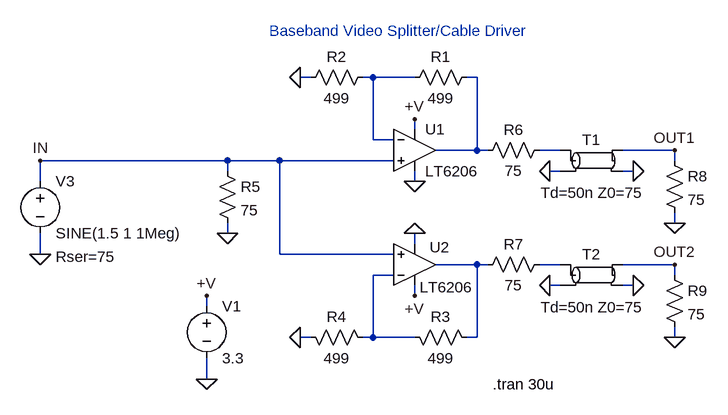
[diagram p0: schematic 6206.asc]
6206.asc, the LTspice schematic file:
Version 4
SHEET 1 896 740
WIRE 16 128 0 128
WIRE 112 128 96 128
WIRE 176 128 112 128
WIRE 272 128 256 128
WIRE 176 208 176 192
WIRE 112 224 112 128
WIRE 144 224 112 224
WIRE 272 240 272 128
WIRE 272 240 208 240
WIRE 288 240 272 240
WIRE 400 240 368 240
WIRE 576 240 496 240
WIRE -112 256 -400 256
WIRE -32 256 -112 256
WIRE 144 256 -32 256
WIRE 576 256 576 240
WIRE -112 272 -112 256
WIRE 400 272 384 272
WIRE 512 272 496 272
WIRE -400 288 -400 256
WIRE 176 288 176 272
WIRE 576 352 576 336
WIRE -112 368 -112 352
WIRE 176 384 176 368
WIRE -400 400 -400 368
WIRE -32 400 -32 256
WIRE 144 400 -32 400
WIRE 272 416 208 416
WIRE 288 416 272 416
WIRE 400 416 368 416
WIRE 576 416 496 416
WIRE 144 432 112 432
WIRE 576 432 576 416
WIRE 400 448 384 448
WIRE 512 448 496 448
WIRE 176 464 176 448
WIRE -144 480 -144 464
WIRE 16 528 0 528
WIRE 112 528 112 432
WIRE 112 528 96 528
WIRE 176 528 112 528
WIRE 272 528 272 416
WIRE 272 528 256 528
WIRE 576 528 576 512
WIRE -144 592 -144 560
FLAG -144 592 0
FLAG 176 192 +V
FLAG -144 464 +V
FLAG 0 128 0
FLAG -400 400 0
FLAG 176 288 0
FLAG 176 464 +V
FLAG 0 528 0
FLAG 176 368 0
FLAG -112 368 0
FLAG 576 240 OUT1
FLAG -400 256 IN
FLAG 576 352 0
FLAG 576 416 OUT2
FLAG 576 528 0
FLAG 384 272 0
FLAG 512 272 0
FLAG 384 448 0
FLAG 512 448 0
SYMBOL voltage -144 464 R0
SYMATTR InstName V1
SYMATTR Value 3.3
SYMBOL res 272 112 R90
WINDOW 0 0 56 VBottom 0
WINDOW 3 32 56 VTop 0
SYMATTR InstName R1
SYMATTR Value 499
SYMBOL res 112 112 R90
WINDOW 0 0 56 VBottom 0
WINDOW 3 32 56 VTop 0
SYMATTR InstName R2
SYMATTR Value 499
SYMBOL voltage -400 272 R0
WINDOW 123 0 0 Left 0
WINDOW 39 24 132 Left 0
SYMATTR InstName V3
SYMATTR Value SINE(1.5 1 1Meg)
SYMATTR SpiceLine Rser=75
SYMBOL res 272 544 M270
WINDOW 0 32 56 VTop 0
WINDOW 3 0 56 VBottom 0
SYMATTR InstName R3
SYMATTR Value 499
SYMBOL res 112 544 M270
WINDOW 0 32 56 VTop 0
WINDOW 3 0 56 VBottom 0
SYMATTR InstName R4
SYMATTR Value 499
SYMBOL res -128 256 R0
SYMATTR InstName R5
SYMATTR Value 75
SYMBOL res 384 224 R90
WINDOW 0 0 56 VBottom 0
WINDOW 3 32 56 VTop 0
SYMATTR InstName R6
SYMATTR Value 75
SYMBOL res 384 400 R90
WINDOW 0 0 56 VBottom 0
WINDOW 3 32 56 VTop 0
SYMATTR InstName R7
SYMATTR Value 75
SYMBOL res 560 240 R0
SYMATTR InstName R8
SYMATTR Value 75
SYMBOL res 560 416 R0
SYMATTR InstName R9
SYMATTR Value 75
SYMBOL tline 448 256 R0
WINDOW 3 2 34 Top 0
SYMATTR InstName T1
SYMATTR Value Td=50n Z0=75
SYMBOL tline 448 432 R0
WINDOW 3 2 34 Top 0
SYMATTR InstName T2
SYMATTR Value Td=50n Z0=75
SYMBOL opamps\\LT6206 176 240 R0
SYMATTR InstName U1
SYMBOL opamps\\LT6206 176 416 M180
WINDOW 0 23 27 Left 0
WINDOW 3 8 -35 Left 0
SYMATTR InstName U2
TEXT 296 600 Left 0 !.tran 30u
TEXT 152 72 Bottom 0 ;Baseband Video Splitter/Cable Driver

The netlist it stands for:
* 6206.asc
V1 +V 0 3.3
R1 N002 N001 499
R2 N001 0 499
V3 IN 0 SINE(1.5 1 1Meg) Rser=75
R3 N004 N006 499
R4 N006 0 499
R5 IN 0 75
R6 N003 N002 75
R7 N005 N004 75
R8 OUT1 0 75
R9 OUT2 0 75
T1 N003 0 OUT1 0 Td=50n Z0=75
T2 N005 0 OUT2 0 Td=50n Z0=75
* U1: LT6206 (symbol opamps\LT6206 not available, pins judged from their places): In+=IN In-=N001 V+=+V V-=0 OUT=N002
* U2: LT6206 (symbol opamps\LT6206 not available, pins judged from their places): In+=IN In-=N006 V+=+V V-=0 OUT=N004
.tran 30u
* Baseband Video Splitter/Cable Driver
.backanno
.end